# Altium project ssmaster.PrjPCB
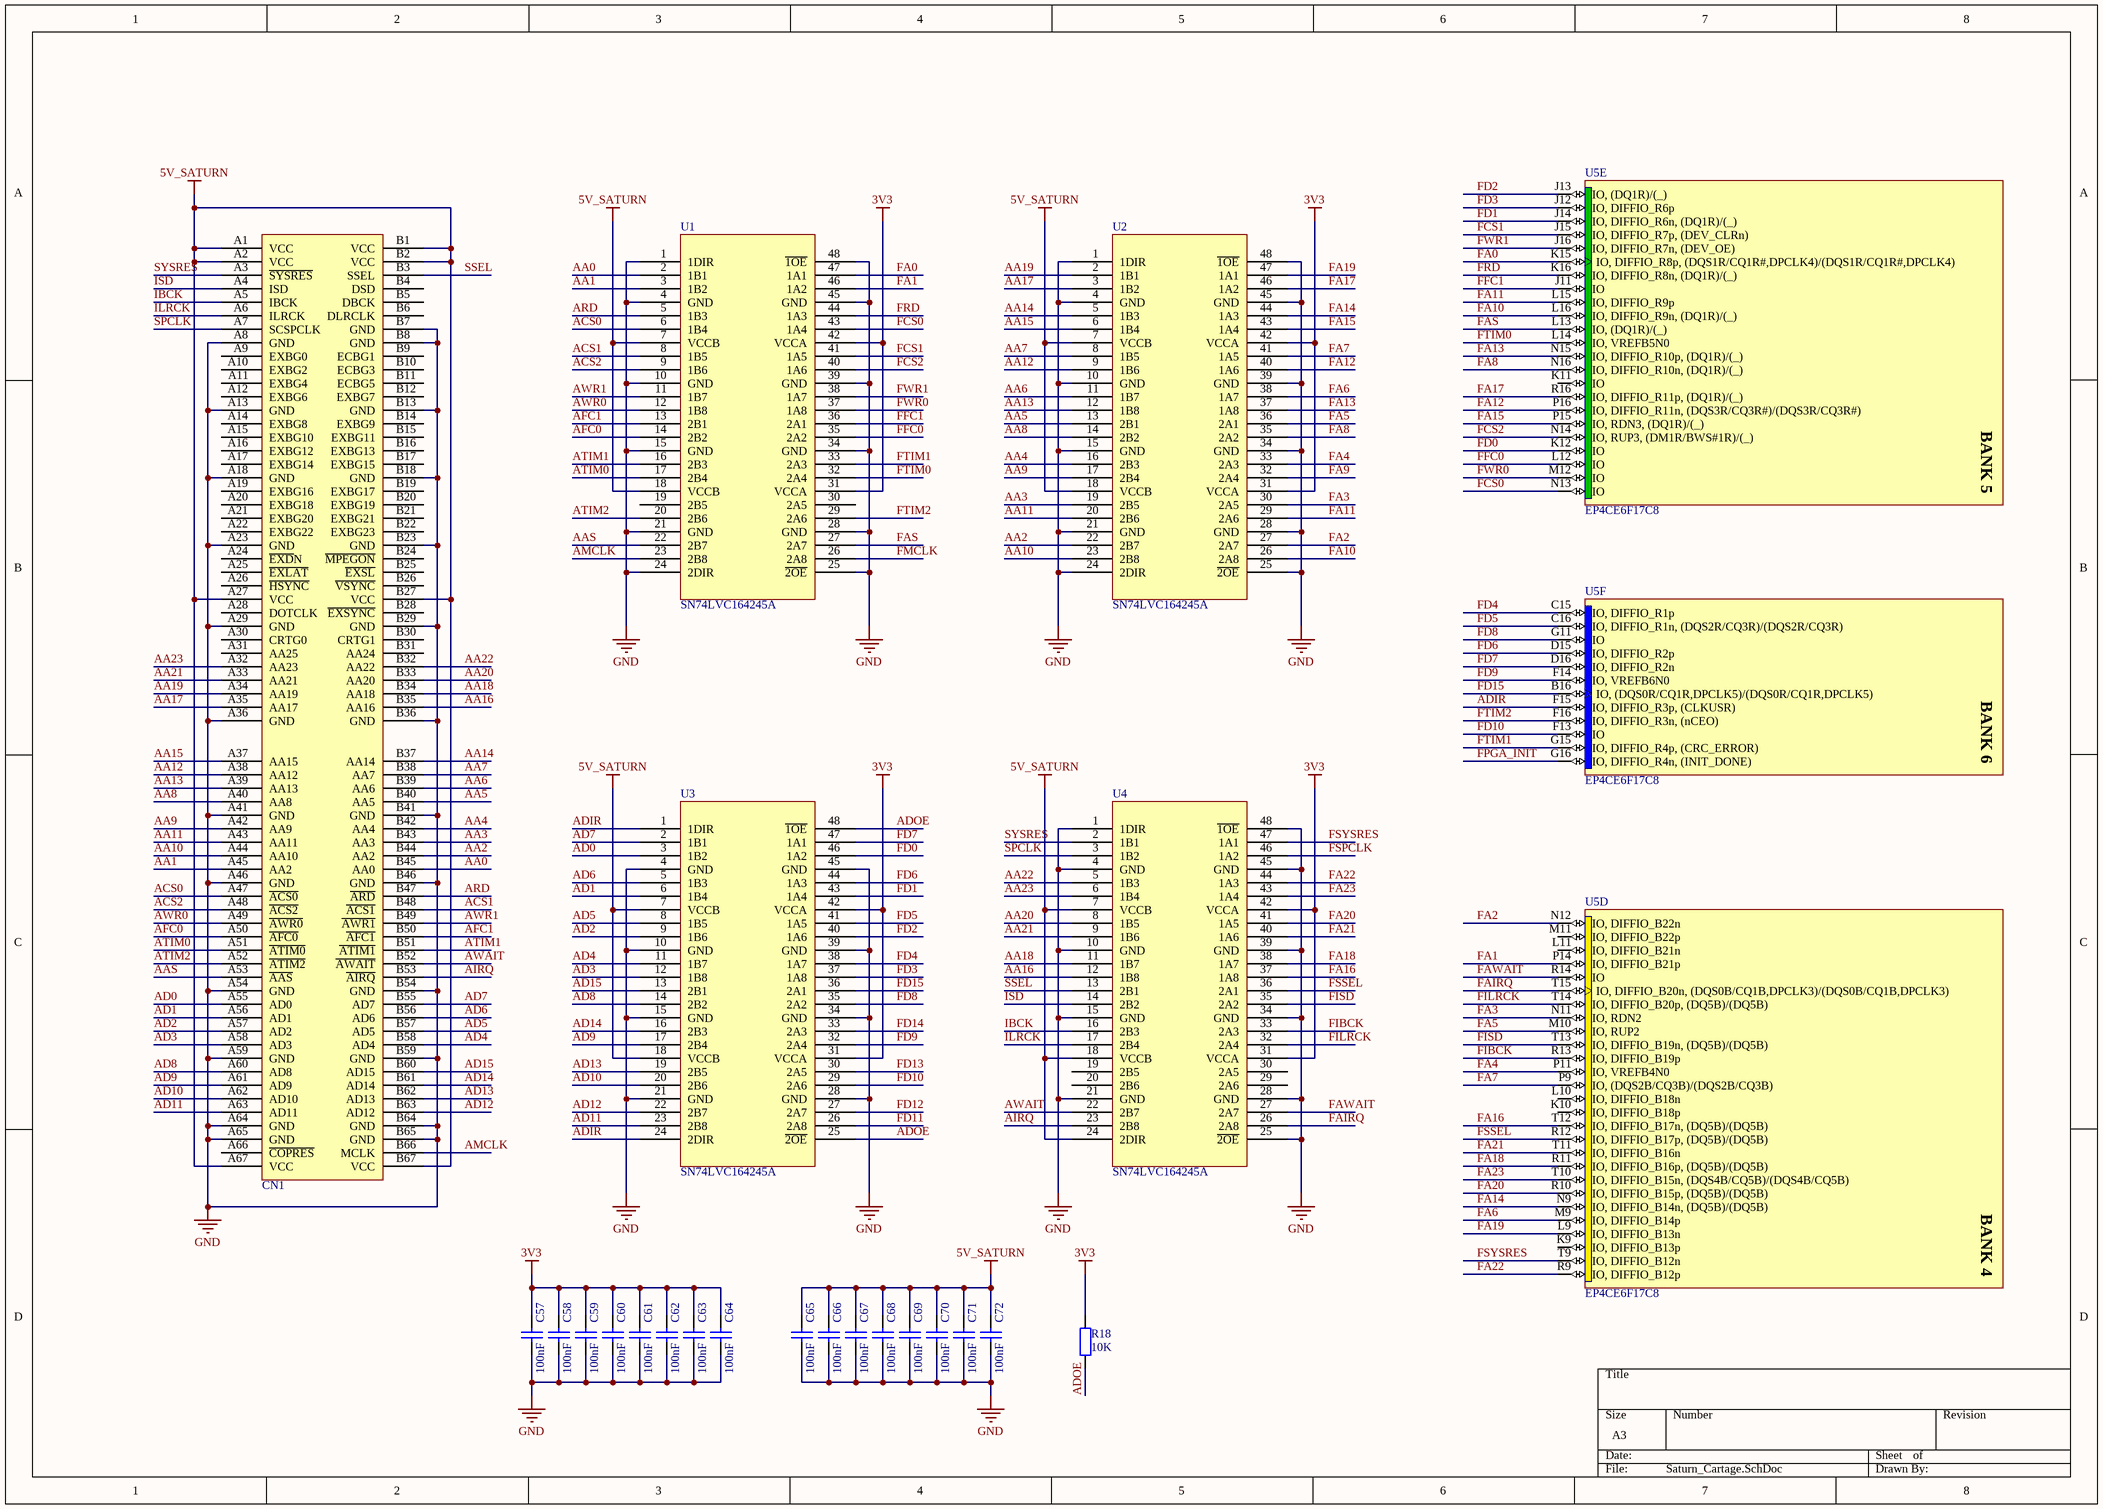
[diagram p0: Saturn_Cartage.SchDoc]
3 sheets, 87 parts. Net scope: global (net labels, ports and power ports of the same name join across sheets).
Board file: ssmaster.PcbDoc
Sheets:
  Saturn_Cartage.SchDoc
  STM32.SchDoc
  Power.SchDoc

## Sheet Saturn_Cartage.SchDoc
size A3

### Parts
C57  100nF  [C0603]
C58  100nF  [C0603]
C59  100nF  [C0603]
C60  100nF  [C0603]
C61  100nF  [C0603]
C62  100nF  [C0603]
C63  100nF  [C0603]
C64  100nF  [C0603]
C65  100nF  [C0603]
C66  100nF  [C0603]
C67  100nF  [C0603]
C68  100nF  [C0603]
C69  100nF  [C0603]
C70  100nF  [C0603]
C71  100nF  [C0603]
C72  100nF  [C0603]
CN1  SaturnCartage  [Saturn_cart]  (value not drawn)
R18  10K  [R0603]
U1  SN74LVC164245A  [DGG048]
U2  SN74LVC164245A  [DGG048]
U3  SN74LVC164245A  [DGG048]
U4  SN74LVC164245A  [DGG048]
U5  EP4CE6F17C8  [FBGA256]  (parts D,E,F of 13)

### Nets
3V3: C57.2 C58.2 C59.2 C60.2 C61.2 C62.2 C63.2 C64.2 R18.2 U1.31(VCCA) U1.42(VCCA) U2.31(VCCA) U2.42(VCCA) U3.31(VCCA) U3.42(VCCA) U4.31(VCCA) U4.42(VCCA)
5V_SATURN: C65.2 C66.2 C67.2 C68.2 C69.2 C70.2 C71.2 C72.2 CN1.A1(VCC) CN1.A2(VCC) CN1.A27(VCC) CN1.A67(VCC) CN1.B1(VCC) CN1.B2(VCC) CN1.B27(VCC) CN1.B67(VCC) U1.7(VCCB) U1.18(VCCB) U2.7(VCCB) U2.18(VCCB) U3.7(VCCB) U3.18(VCCB) U4.7(VCCB) U4.18(VCCB) U4.24(2DIR)
GND: C57.1 C58.1 C59.1 C60.1 C61.1 C62.1 C63.1 C64.1 C65.1 C66.1 C67.1 C68.1 C69.1 C70.1 C71.1 C72.1 CN1.A8(GND) CN1.A13(GND) CN1.A18(GND) CN1.A23(GND) CN1.A29(GND) CN1.A36(GND) CN1.A41(GND) CN1.A46(GND) CN1.A54(GND) CN1.A59(GND) CN1.A64(GND) CN1.A65(GND) CN1.B7(GND) CN1.B8(GND) CN1.B13(GND) CN1.B18(GND) CN1.B23(GND) CN1.B29(GND) CN1.B36(GND) CN1.B41(GND) CN1.B46(GND) CN1.B54(GND) CN1.B59(GND) CN1.B64(GND) CN1.B65(GND) U1.1(1DIR) U1.4(GND) U1.10(GND) U1.15(GND) U1.21(GND) U1.24(2DIR) U1.25(~{2OE}) U1.28(GND) U1.34(GND) U1.39(GND) U1.45(GND) U1.48(~{1OE}) U2.1(1DIR) U2.4(GND) U2.10(GND) U2.15(GND) U2.21(GND) U2.24(2DIR) U2.25(~{2OE}) U2.28(GND) U2.34(GND) U2.39(GND) U2.45(GND) U2.48(~{1OE}) U3.4(GND) U3.10(GND) U3.15(GND) U3.21(GND) U3.28(GND) U3.34(GND) U3.39(GND) U3.45(GND) U4.1(1DIR) U4.4(GND) U4.10(GND) U4.15(GND) U4.21(GND) U4.25(~{2OE}) U4.28(GND) U4.34(GND) U4.39(GND) U4.45(GND) U4.48(~{1OE})
AA0: CN1.B45(AA0) U1.2(1B1)
AA1: CN1.A45(AA2) U1.3(1B2)
AA2: CN1.B44(AA2) U2.22(2B7)
AA3: CN1.B43(AA3) U2.19(2B5)
AA4: CN1.B42(AA4) U2.16(2B3)
AA5: CN1.B40(AA5) U2.13(2B1)
AA6: CN1.B39(AA6) U2.11(1B7)
AA7: CN1.B38(AA7) U2.8(1B5)
AA8: CN1.A40(AA8) U2.14(2B2)
AA9: CN1.A42(AA9) U2.17(2B4)
AA10: CN1.A44(AA10) U2.23(2B8)
AA11: CN1.A43(AA11) U2.20(2B6)
AA12: CN1.A38(AA12) U2.9(1B6)
AA13: CN1.A39(AA13) U2.12(1B8)
AA14: CN1.B37(AA14) U2.5(1B3)
AA15: CN1.A37(AA15) U2.6(1B4)
AA16: CN1.B35(AA16) U4.12(1B8)
AA17: CN1.A35(AA17) U2.3(1B2)
AA18: CN1.B34(AA18) U4.11(1B7)
AA19: CN1.A34(AA19) U2.2(1B1)
AA20: CN1.B33(AA20) U4.8(1B5)
AA21: CN1.A33(AA21) U4.9(1B6)
AA22: CN1.B32(AA22) U4.5(1B3)
AA23: CN1.A32(AA23) U4.6(1B4)
AAS: CN1.A53(~{AAS}) U1.22(2B7)
ACS0: CN1.A47(~{ACS0}) U1.6(1B4)
ACS1: CN1.B48(~{ACS1}) U1.8(1B5)
ACS2: CN1.A48(~{ACS2}) U1.9(1B6)
AD0: CN1.A55(AD0) U3.3(1B2)
AD1: CN1.A56(AD1) U3.6(1B4)
AD2: CN1.A57(AD2) U3.9(1B6)
AD3: CN1.A58(AD3) U3.12(1B8)
AD4: CN1.B58(AD4) U3.11(1B7)
AD5: CN1.B57(AD5) U3.8(1B5)
AD6: CN1.B56(AD6) U3.5(1B3)
AD7: CN1.B55(AD7) U3.2(1B1)
AD8: CN1.A60(AD8) U3.14(2B2)
AD9: CN1.A61(AD9) U3.17(2B4)
AD10: CN1.A62(AD10) U3.20(2B6)
AD11: CN1.A63(AD11) U3.23(2B8)
AD12: CN1.B63(AD12) U3.22(2B7)
AD13: CN1.B62(AD13) U3.19(2B5)
AD14: CN1.B61(AD14) U3.16(2B3)
AD15: CN1.B60(AD15) U3.13(2B1)
ADIR: U3.1(1DIR) U3.24(2DIR) U5.F15(IO,_DIFFIO_R3p,_(CLKUSR))
ADOE: R18.1 U3.25(~{2OE}) U3.48(~{1OE})
AFC0: CN1.A50(~{AFC0}) U1.14(2B2)
AFC1: CN1.B50(~{AFC1}) U1.13(2B1)
AIRQ: CN1.B53(~{AIRQ}) U4.23(2B8)
AMCLK: CN1.B66(MCLK) U1.23(2B8)
ARD: CN1.B47(~{ARD}) U1.5(1B3)
ATIM0: CN1.A51(~{ATIM0}) U1.17(2B4)
ATIM1: CN1.B51(~{ATIM1}) U1.16(2B3)
ATIM2: CN1.A52(~{ATIM2}) U1.20(2B6)
AWAIT: CN1.B52(~{AWAIT}) U4.22(2B7)
AWR0: CN1.A49(~{AWR0}) U1.12(1B8)
AWR1: CN1.B49(~{AWR1}) U1.11(1B7)
FA0: U1.47(1A1) U5.K15(IO,_DIFFIO_R8p,_(DQS1R/CQ1R#,DPCLK4)/(DQS1R/CQ1R#,DPCLK4))
FA1: U1.46(1A2) U5.P14(IO,_DIFFIO_B21p)
FA2: U2.27(2A7) U5.N12(IO,_DIFFIO_B22n)
FA3: U2.30(2A5) U5.N11(IO,_RDN2)
FA4: U2.33(2A3) U5.P11(IO,_VREFB4N0)
FA5: U2.36(2A1) U5.M10(IO,_RUP2)
FA6: U2.38(1A7) U5.M9(IO,_DIFFIO_B14p)
FA7: U2.41(1A5) U5.P9(IO,_(DQS2B/CQ3B)/(DQS2B/CQ3B))
FA8: U2.35(2A2) U5.N16(IO,_DIFFIO_R10n,_(DQ1R)/(_))
FA9: U2.32(2A4)
FA10: U2.26(2A8) U5.L16(IO,_DIFFIO_R9n,_(DQ1R)/(_))
FA11: U2.29(2A6) U5.L15(IO,_DIFFIO_R9p)
FA12: U2.40(1A6) U5.P16(IO,_DIFFIO_R11n,_(DQS3R/CQ3R#)/(DQS3R/CQ3R#))
FA13: U2.37(1A8) U5.N15(IO,_DIFFIO_R10p,_(DQ1R)/(_))
FA14: U2.44(1A3) U5.N9(IO,_DIFFIO_B14n,_(DQ5B)/(DQ5B))
FA15: U2.43(1A4) U5.P15(IO,_RDN3,_(DQ1R)/(_))
FA16: U4.37(1A8) U5.T12(IO,_DIFFIO_B17n,_(DQ5B)/(DQ5B))
FA17: U2.46(1A2) U5.R16(IO,_DIFFIO_R11p,_(DQ1R)/(_))
FA18: U4.38(1A7) U5.R11(IO,_DIFFIO_B16p,_(DQ5B)/(DQ5B))
FA19: U2.47(1A1) U5.L9(IO,_DIFFIO_B13n)
FA20: U4.41(1A5) U5.R10(IO,_DIFFIO_B15p,_(DQ5B)/(DQ5B))
FA21: U4.40(1A6) U5.T11(IO,_DIFFIO_B16n)
FA22: U4.44(1A3) U5.R9(IO,_DIFFIO_B12p)
FA23: U4.43(1A4) U5.T10(IO,_DIFFIO_B15n,_(DQS4B/CQ5B)/(DQS4B/CQ5B))
FAIRQ: U4.26(2A8) U5.T15(IO,_DIFFIO_B20n,_(DQS0B/CQ1B,DPCLK3)/(DQS0B/CQ1B,DPCLK3))
FAS: U1.27(2A7) U5.L13(IO,_(DQ1R)/(_))
FAWAIT: U4.27(2A7) U5.R14(IO)
FCS0: U1.43(1A4) U5.N13(IO)
FCS1: U1.41(1A5) U5.J15(IO,_DIFFIO_R7p,_(DEV_CLRn))
FCS2: U1.40(1A6) U5.N14(IO,_RUP3,_(DM1R/BWS#1R)/(_))
FD0: U3.46(1A2) U5.K12(IO)
FD1: U3.43(1A4) U5.J14(IO,_DIFFIO_R6n,_(DQ1R)/(_))
FD2: U3.40(1A6) U5.J13(IO,_(DQ1R)/(_))
FD3: U3.37(1A8) U5.J12(IO,_DIFFIO_R6p)
FD4: U3.38(1A7) U5.C15(IO,_DIFFIO_R1p)
FD5: U3.41(1A5) U5.C16(IO,_DIFFIO_R1n,_(DQS2R/CQ3R)/(DQS2R/CQ3R))
FD6: U3.44(1A3) U5.D15(IO,_DIFFIO_R2p)
FD7: U3.47(1A1) U5.D16(IO,_DIFFIO_R2n)
FD8: U3.35(2A2) U5.G11(IO)
FD9: U3.32(2A4) U5.F14(IO,_VREFB6N0)
FD10: U3.29(2A6) U5.F13(IO)
FD11: U3.26(2A8)
FD12: U3.27(2A7)
FD13: U3.30(2A5)
FD14: U3.33(2A3)
FD15: U3.36(2A1) U5.B16(IO,_(DQS0R/CQ1R,DPCLK5)/(DQS0R/CQ1R,DPCLK5))
FFC0: U1.35(2A2) U5.L12(IO)
FFC1: U1.36(2A1) U5.J11(IO)
FIBCK: U4.33(2A3) U5.R13(IO,_DIFFIO_B19p)
FILRCK: U4.32(2A4) U5.T14(IO,_DIFFIO_B20p,_(DQ5B)/(DQ5B))
FISD: U4.35(2A2) U5.T13(IO,_DIFFIO_B19n,_(DQ5B)/(DQ5B))
FMCLK: U1.26(2A8)
FPGA_INIT: U5.G16(IO,_DIFFIO_R4n,_(INIT_DONE))
FRD: U1.44(1A3) U5.K16(IO,_DIFFIO_R8n,_(DQ1R)/(_))
FSPCLK: U4.46(1A2)
FSSEL: U4.36(2A1) U5.R12(IO,_DIFFIO_B17p,_(DQ5B)/(DQ5B))
FSYSRES: U4.47(1A1) U5.T9(IO,_DIFFIO_B12n)
FTIM0: U1.32(2A4) U5.L14(IO,_VREFB5N0)
FTIM1: U1.33(2A3) U5.G15(IO,_DIFFIO_R4p,_(CRC_ERROR))
FTIM2: U1.29(2A6) U5.F16(IO,_DIFFIO_R3n,_(nCEO))
FWR0: U1.37(1A8) U5.M12(IO)
FWR1: U1.38(1A7) U5.J16(IO,_DIFFIO_R7n,_(DEV_OE))
IBCK: CN1.A5(IBCK) U4.16(2B3)
ILRCK: CN1.A6(ILRCK) U4.17(2B4)
ISD: CN1.A4(ISD) U4.14(2B2)
SPCLK: CN1.A7(SCSPCLK) U4.3(1B2)
SSEL: CN1.B3(SSEL) U4.13(2B1)
SYSRES: CN1.A3(~{SYSRES}) U4.2(1B1)

Not connected (* = marked no-connect by the designer): CN1 A9(EXBG0) A10(EXBG2) A11(EXBG4) A12(EXBG6) A14(EXBG8) A15(EXBG10) A16(EXBG12) A17(EXBG14) A19(EXBG16) A20(EXBG18) A21(EXBG20) A22(EXBG22) A24(~{EXD}N) A25(~{EXLAT}) A26(~{HSYNC}) A28(DOTCLK) A30(CRTG0) A31(AA25) A66(~{COPRES}) B4(DSD) B5(DBCK) B6(DLRCLK) B9(ECBG1) B10(ECBG3) B11(ECBG5) B12(EXBG7) B14(EXBG9) B15(EXBG11) B16(EXBG13) B17(EXBG15) B19(EXBG17) B20(EXBG19) B21(EXBG21) B22(EXBG23) B24(~{MPEGON}) B25(~{EXSL}) B26(~{VSYNC}) B28(~{EXSYNC}) B30(CRTG1) B31(AA24); U1 19(2B5) 30(2A5); U4 19(2B5) 20(2B6) 29(2A6) 30(2A5); U5 K9(IO,_DIFFIO_B13p) K10(IO,_DIFFIO_B18p) K11(IO) L10(IO,_DIFFIO_B18n) L11(IO,_DIFFIO_B21n) M11(IO,_DIFFIO_B22p)

### Notes on the sheet
- (in symbol EP4CE6F17C8, part D) BANK 4
- (in symbol EP4CE6F17C8, part E) BANK 5
- (in symbol EP4CE6F17C8, part F) BANK 6

### Library data of the parts
C57-C72 = Cap: Capacitor; Published: 8-Jun-2000; LatestRevisionDate: 17-Jul-2002; LatestRevisionNote: Re-released for DXP Platform.; PackageReference: RAD-0.3; Publisher: Altium Limited
R18 = Res2: Resistor; Published: 8-Jun-2000; LatestRevisionDate: 17-Jul-2002; LatestRevisionNote: Re-released for DXP Platform.; PackageReference: AXIAL-0.4; Publisher: Altium Limited
U5 = EP4CE6F17C8: Cyclone IV Family FPGA, 2V Core, 179 I/O Pins, 2 PLLs, 256-Pin FBGA, Speed Grade 8, Commercial Grade; Published: 3-May-2010; DatasheetVersion: ver1.2, Mar-2010; PackageVersion: ver16.0, Dec-2009; PackageReference: FBGA256; Publisher: Altium Limited; PackageDescription: 256-Ball FineLine Ball Grid Array (FBGA256) - Option 1 - Wire Bond; Code_JEDEC: MS-034-AAF-1; Code_IPC: BGA100P16X16-256; ComponentLink1Description: Manufacturer Link; ComponentLink1URL: http://www.altera.com/; ComponentLink2Description: Handbook; ComponentLink2URL: http://www.altera.com/literature/hb/cyclone-iv/cyclone4-handbook.pdf; ComponentLink3Description: Pinout Specification; ComponentLink3URL: http://www.altera.com/literature/lit-dp.jsp?category=cyc%204&showspreadsheet=y; ComponentLink4Description: Packaging Specification; ComponentLink4URL: http://www.altera.com/literature/ds/dspkg.pdf

## Sheet STM32.SchDoc
size A3
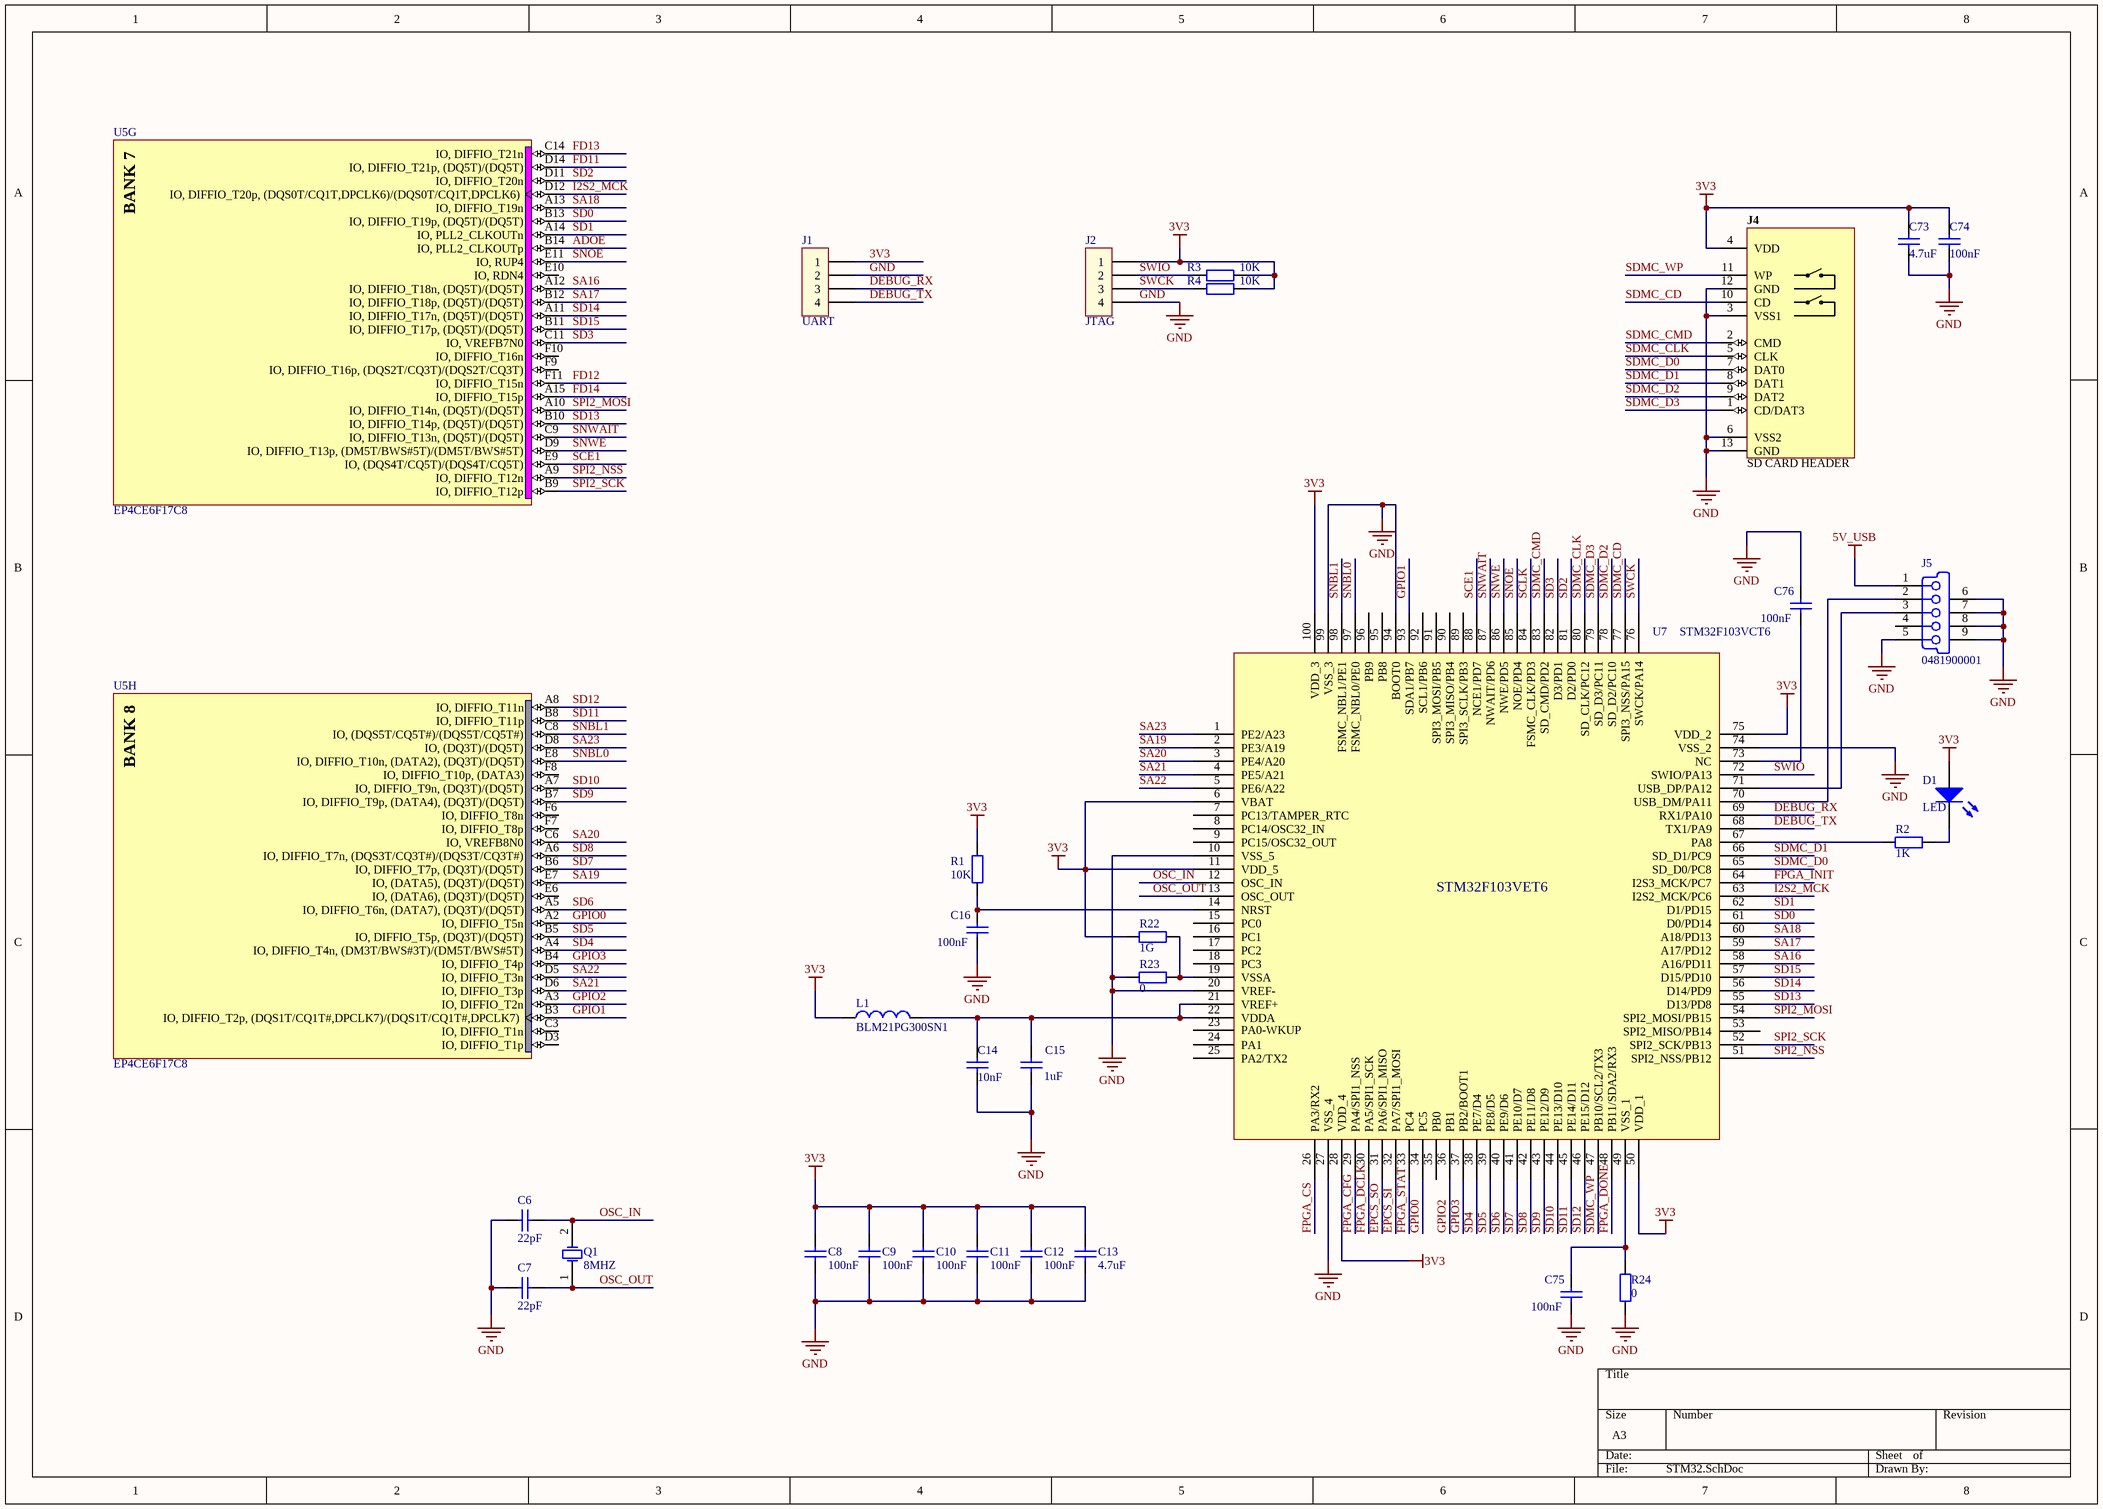
[diagram p1: STM32.SchDoc]

### Parts
C6  22pF  [C0603]
C7  22pF  [C0603]
C8  100nF  [C0603]
C9  100nF  [C0603]
C10  100nF  [C0603]
C11  100nF  [C0603]
C12  100nF  [C0603]
C13  4.7uF  [C0603]
C14  10nF  [C0603]
C15  1uF  [C0603]
C16  100nF  [C0603]
C73  4.7uF  [C0603]
C74  100nF  [C0603]
C75  100nF  [C0603]
C76  100nF  [C0603]
D1  LED  [D0603]
J1  UART  [SIP4]
J2  JTAG  [SIP4]
J4  SD CARD HEADER  [KSDC012551]
J5  0481900001  [Micro USB]
L1  BLM21PG300SN1  [R0805]
Q1  8MHZ  [SMD_CRYSTAL]
R1  10K  [R0603]
R2  1K  [R0603]
R3  10K  [R0603]
R4  10K  [R0603]
R22  1G  [R0603]
R23  0  [R0603]
R24  0  [R0603]
U5  EP4CE6F17C8  [FBGA256]  (parts G,H of 13)
U7  STM32F103VCT6  [TQFP-100]

### Nets
3V3: C8.2 C9.2 C10.2 C11.2 C12.2 C13.2 C73.2 C74.2 D1.1 J1.1 J2.1 J4.4(VDD) L1.1 R1.2 R3.2 R4.2 R22.2 U7.6(VBAT) U7.11(VDD_5) U7.28(VDD_4) U7.50(VDD_1) U7.75(VDD_2) U7.100(VDD_3)
5V_USB: J5.1(V_BUS_(5V))
GND: C6.2 C7.2 C8.1 C9.1 C10.1 C11.1 C12.1 C13.1 C14.1 C15.1 C16.2 C73.1 C74.1 C75.2 C76.1 J1.2 J2.4 J4.3(VSS1) J4.6(VSS2) J4.12(GND) J4.13(GND) J5.5(GND) J5.6(Tab) J5.7(Tab) J5.8(Tab) J5.9(Tab) R23.2 R24.2 U7.10(VSS_5) U7.20(VREF-) U7.27(VSS_4) U7.74(VSS_2) U7.94(BOOT0) U7.99(VSS_3)
ADOE: U5.B14(IO,_PLL2_CLKOUTp)
DEBUG_RX: J1.3 U7.69(RX1/PA10)
DEBUG_TX: J1.4 U7.68(TX1/PA9)
EPCS_SI: U7.32(PA7/SPI1_MOSI)
EPCS_SO: U7.31(PA6/SPI1_MISO)
FD11: U5.D14(IO,_DIFFIO_T21p,_(DQ5T)/(DQ5T))
FD12: U5.F11(IO,_DIFFIO_T15n)
FD13: U5.C14(IO,_DIFFIO_T21n)
FD14: U5.A15(IO,_DIFFIO_T15p)
FPGA_CFG: U7.29(PA4/SPI1_NSS)
FPGA_CS: U7.26(PA3/RX2)
FPGA_DCLK: U7.30(PA5/SPI1_SCK)
FPGA_DONE: U7.48(PB11/SDA2/RX3)
FPGA_INIT: U7.64(I2S3_MCK/PC7)
FPGA_STAT: U7.33(PC4)
GPIO0: U5.A2(IO,_DIFFIO_T5n) U7.34(PC5)
GPIO1: U5.B3(IO,_DIFFIO_T2p,_(DQS1T/CQ1T#,DPCLK7)/(DQS1T/CQ1T#,DPCLK7)) U7.93(SDA1/PB7)
GPIO2: U5.A3(IO,_DIFFIO_T2n) U7.36(PB1)
GPIO3: U5.B4(IO,_DIFFIO_T4p) U7.37(PB2/BOOT1)
I2S2_MCK: U5.D12(IO,_DIFFIO_T20p,_(DQS0T/CQ1T,DPCLK6)/(DQS0T/CQ1T,DPCLK6)) U7.63(I2S2_MCK/PC6)
OSC_IN: C6.1 Q1.2(OSC2) U7.12(OSC_IN)
OSC_OUT: C7.1 Q1.1(OSC1) U7.13(OSC_OUT)
SA16: U5.A12(IO,_DIFFIO_T18n,_(DQ5T)/(DQ5T)) U7.58(A16/PD11)
SA17: U5.B12(IO,_DIFFIO_T18p,_(DQ5T)/(DQ5T)) U7.59(A17/PD12)
SA18: U5.A13(IO,_DIFFIO_T19n) U7.60(A18/PD13)
SA19: U5.E7(IO,_(DATA5),_(DQ3T)/(DQ5T)) U7.2(PE3/A19)
SA20: U5.C6(IO,_VREFB8N0) U7.3(PE4/A20)
SA21: U5.D6(IO,_DIFFIO_T3p) U7.4(PE5/A21)
SA22: U5.D5(IO,_DIFFIO_T3n) U7.5(PE6/A22)
SA23: U5.D8(IO,_(DQ3T)/(DQ5T)) U7.1(PE2/A23)
SCE1: U5.E9(IO,_(DQS4T/CQ5T)/(DQS4T/CQ5T)) U7.88(NCE1/PD7)
SCLK: U7.84(FSMC_CLK/PD3)
SD0: U5.B13(IO,_DIFFIO_T19p,_(DQ5T)/(DQ5T)) U7.61(D0/PD14)
SD1: U5.A14(IO,_PLL2_CLKOUTn) U7.62(D1/PD15)
SD2: U5.D11(IO,_DIFFIO_T20n) U7.81(D2/PD0)
SD3: U5.C11(IO,_VREFB7N0) U7.82(D3/PD1)
SD4: U5.A4(IO,_DIFFIO_T4n,_(DM3T/BWS#3T)/(DM5T/BWS#5T)) U7.38(PE7/D4)
SD5: U5.B5(IO,_DIFFIO_T5p,_(DQ3T)/(DQ5T)) U7.39(PE8/D5)
SD6: U5.A5(IO,_DIFFIO_T6n,_(DATA7),_(DQ3T)/(DQ5T)) U7.40(PE9/D6)
SD7: U5.B6(IO,_DIFFIO_T7p,_(DQ3T)/(DQ5T)) U7.41(PE10/D7)
SD8: U5.A6(IO,_DIFFIO_T7n,_(DQS3T/CQ3T#)/(DQS3T/CQ3T#)) U7.42(PE11/D8)
SD9: U5.B7(IO,_DIFFIO_T9p,_(DATA4),_(DQ3T)/(DQ5T)) U7.43(PE12/D9)
SD10: U5.A7(IO,_DIFFIO_T9n,_(DQ3T)/(DQ5T)) U7.44(PE13/D10)
SD11: U5.B8(IO,_DIFFIO_T11p) U7.45(PE14/D11)
SD12: U5.A8(IO,_DIFFIO_T11n) U7.46(PE15/D12)
SD13: U5.B10(IO,_DIFFIO_T14p,_(DQ5T)/(DQ5T)) U7.55(D13/PD8)
SD14: U5.A11(IO,_DIFFIO_T17n,_(DQ5T)/(DQ5T)) U7.56(D14/PD9)
SD15: U5.B11(IO,_DIFFIO_T17p,_(DQ5T)/(DQ5T)) U7.57(D15/PD10)
SDMC_CD: J4.10(CD) U7.77(SPI3_NSS/PA15)
SDMC_CLK: J4.5(CLK) U7.80(SD_CLK/PC12)
SDMC_CMD: J4.2(CMD) U7.83(SD_CMD/PD2)
SDMC_D0: J4.7(DAT0) U7.65(SD_D0/PC8)
SDMC_D1: J4.8(DAT1) U7.66(SD_D1/PC9)
SDMC_D2: J4.9(DAT2) U7.78(SD_D2/PC10)
SDMC_D3: J4.1(CD/DAT3) U7.79(SD_D3/PC11)
SDMC_WP: J4.11(WP) U7.47(PB10/SCL2/TX3)
SNBL0: U5.E8(IO,_DIFFIO_T10n,_(DATA2),_(DQ3T)/(DQ5T)) U7.97(FSMC_NBL0/PE0)
SNBL1: U5.C8(IO,_(DQS5T/CQ5T#)/(DQS5T/CQ5T#)) U7.98(FSMC_NBL1/PE1)
SNOE: U5.E11(IO,_RUP4) U7.85(NOE/PD4)
SNWAIT: U5.C9(IO,_DIFFIO_T13n,_(DQ5T)/(DQ5T)) U7.87(NWAIT/PD6)
SNWE: U5.D9(IO,_DIFFIO_T13p,_(DM5T/BWS#5T)/(DM5T/BWS#5T)) U7.86(NWE/PD5)
SPI2_MOSI: U5.A10(IO,_DIFFIO_T14n,_(DQ5T)/(DQ5T)) U7.54(SPI2_MOSI/PB15)
SPI2_NSS: U5.A9(IO,_DIFFIO_T12n) U7.51(SPI2_NSS/PB12)
SPI2_SCK: U5.B9(IO,_DIFFIO_T12p) U7.52(SPI2_SCK/PB13)
SWCK: J2.3 R4.1 U7.76(SWCK/PA14)
SWIO: J2.2 R3.1 U7.72(SWIO/PA13)
NetC14_2: C14.2 C15.2 L1.2 U7.21(VREF+) U7.22(VDDA)
NetC16_1: C16.1 R1.1 U7.14(NRST)
NetC75_1: C75.1 R24.1 U7.49(VSS_1)
NetC76_2: C76.2 U7.73(NC)
NetD1_2: D1.2 R2.1
NetJ5_2: J5.2(D-) U7.70(USB_DM/PA11)
NetJ5_3: J5.3(D+) U7.71(USB_DP/PA12)
NetR2_2: R2.2 U7.67(PA8)
NetR22_1: R22.1 R23.1 U7.19(VSSA)

Not connected (* = marked no-connect by the designer): J5 4(NC); U5 C3(IO,_DIFFIO_T1n) D3(IO,_DIFFIO_T1p) E6(IO,_(DATA6),_(DQ3T)/(DQ5T)) E10(IO,_RDN4) F6(IO,_DIFFIO_T8n) F7(IO,_DIFFIO_T8p) F8(IO,_DIFFIO_T10p,_(DATA3)) F9(IO,_DIFFIO_T16p,_(DQS2T/CQ3T)/(DQS2T/CQ3T)) F10(IO,_DIFFIO_T16n); U7 7(PC13/TAMPER_RTC) 8(PC14/OSC32_IN) 9(PC15/OSC32_OUT) 15(PC0) 16(PC1) 17(PC2) 18(PC3) 23(PA0-WKUP) 24(PA1) 25(PA2/TX2) 35(PB0) 53(SPI2_MISO/PB14) 89(SPI3_SCLK/PB3) 90(SPI3_MISO/PB4) 91(SPI3_MOSI/PB5) 92(SCL1/PB6) 95(PB8) 96(PB9)

### Notes on the sheet
- (in symbol EP4CE6F17C8, part G) BANK 7
- (in symbol EP4CE6F17C8, part H) BANK 8
- (in symbol STM32F103VCT6) STM32F103VET6

### Library data of the parts
C6-C16 C73-C76 = Cap: Capacitor; Published: 8-Jun-2000; LatestRevisionDate: 17-Jul-2002; LatestRevisionNote: Re-released for DXP Platform.; PackageReference: RAD-0.3; Publisher: Altium Limited
D1 = LED1: Typical RED GaAs LED; Published: 8-Jun-2000; LatestRevisionDate: 08-Jul-2005; LatestRevisionNote: Mech Layer 1 removed.; PackageReference: LED-1; Publisher: Altium Limited
J1 J2 = SIP4
J4 = KSDC012551-9: Secure Digital Card Socket; Max Current: mA; Connector type: Header; Mounting Technology: Surface Mount; Status: Production; Category: Connector
J5 = 0481900001: USB On-The-Go (OTG) Mini-B Receptacle, Right Angle, SMT, 0.80mm (.031") Pitch, Solder Tabs with Back Cover, Recessed Type; PCB_Layout: Complies with Manufacturer's Recommendation.; Published: 21-Sep-2007; DatasheetVersion: revA, May-2004; PackageVersion: May-2004; PackageReference: 481900001; Publisher: Altium Limited; PackageDescription: USB Mini-B, Sinking Type, SM; 5 Position; Right Angle, Body 11.45 x 11.8 x 3.9 mm (LxWxH); ComponentLink1Description: Manufacturer Link; ComponentLink1URL: http://www.molex.com/; ComponentLink2Description: Datasheet; ComponentLink2URL: http://www.molex.com/cmc_upload/0/000/895/958/SD-48190-001RevA.pdf
L1 = Inductor: Code_IEC: 1005; Published: 8-Jun-2000; LatestRevisionDate: 17-Jul-2002; LatestRevisionNote: Re-released for DXP Platform.; PackageReference: 0402-A; Publisher: Altium Limited; Code_JEITA: 0402
Q1 = XTAL: Crystal Oscillator; Published: 8-Jun-2000; LatestRevisionDate: 17-Jul-2002; LatestRevisionNote: Re-released for DXP Platform.; PackageReference: R38; Publisher: Altium Limited
R1-R4 R22-R24 = Res2: Resistor; Published: 8-Jun-2000; LatestRevisionDate: 17-Jul-2002; LatestRevisionNote: Re-released for DXP Platform.; PackageReference: AXIAL-0.4; Publisher: Altium Limited
U5 = EP4CE6F17C8: as U5 on sheet Saturn_Cartage; Published: 3-May-2010; DatasheetVersion: ver1.2, Mar-2010; PackageVersion: ver16.0, Dec-2009; PackageReference: FBGA256; Publisher: Altium Limited; PackageDescription: 256-Ball FineLine Ball Grid Array (FBGA256) - Option 1 - Wire Bond; Code_JEDEC: MS-034-AAF-1; Code_IPC: BGA100P16X16-256; ComponentLink1Description: Manufacturer Link; ComponentLink1URL: http://www.altera.com/; ComponentLink2Description: Handbook; ComponentLink2URL: http://www.altera.com/literature/hb/cyclone-iv/cyclone4-handbook.pdf; ComponentLink3Description: Pinout Specification; ComponentLink3URL: http://www.altera.com/literature/lit-dp.jsp?category=cyc%204&showspreadsheet=y; ComponentLink4Description: Packaging Specification; ComponentLink4URL: http://www.altera.com/literature/ds/dspkg.pdf

## Sheet Power.SchDoc
size A4
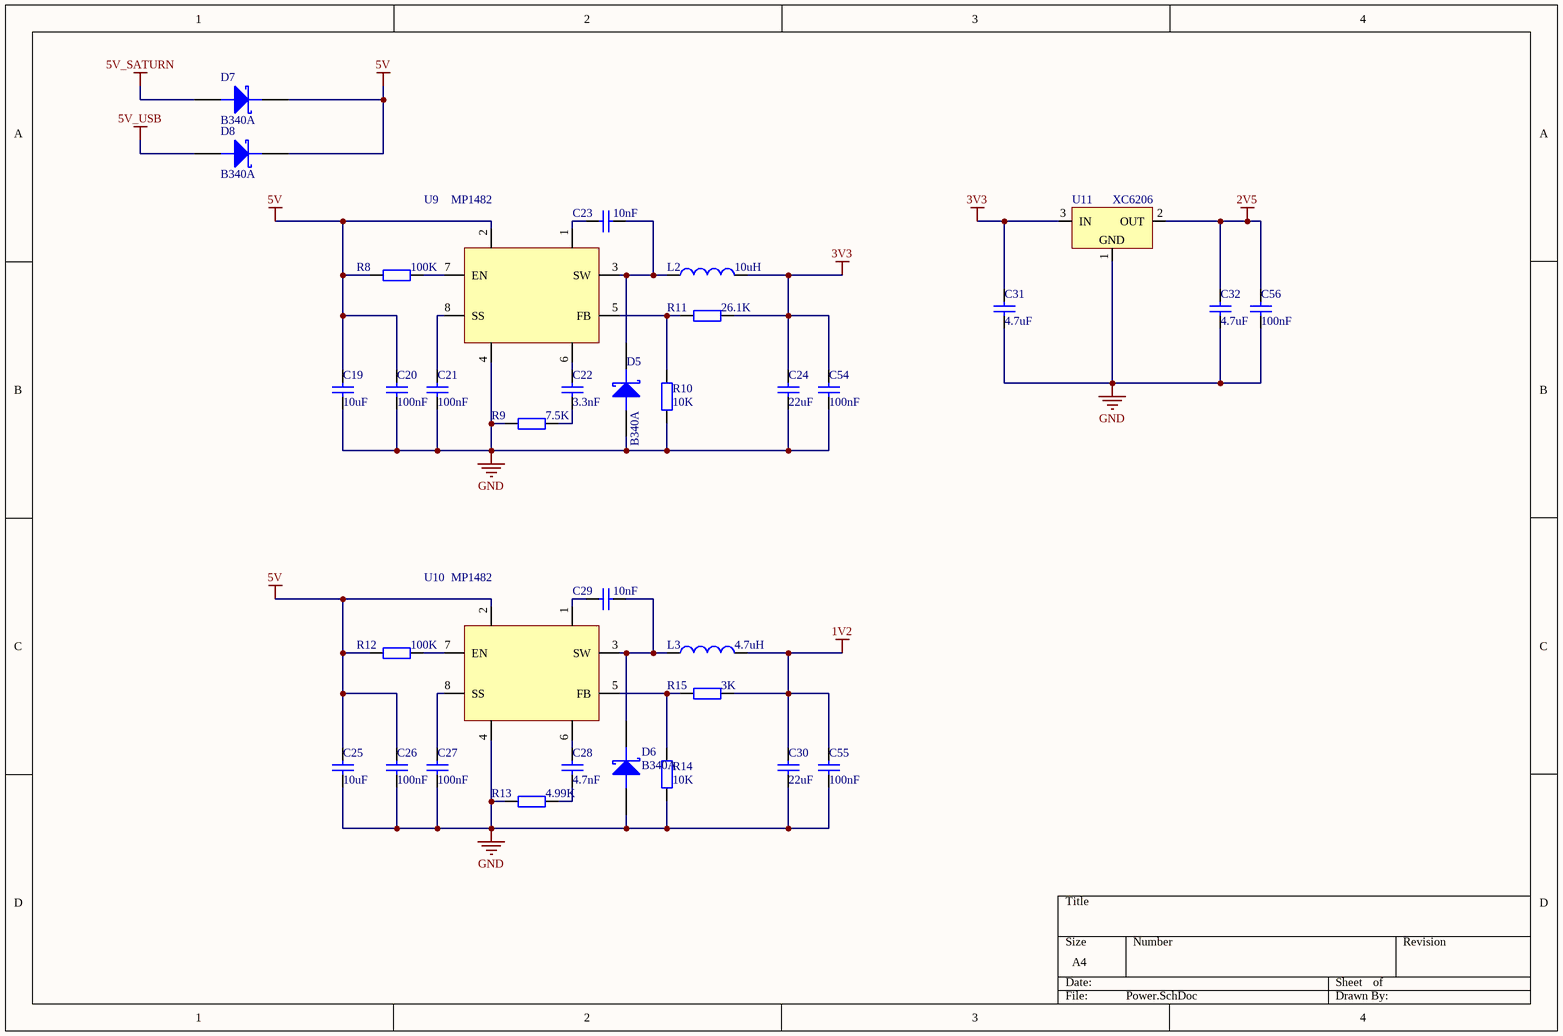
[diagram p2: Power.SchDoc]

### Parts
C19  10uF  [C1206]
C20  100nF  [C0603]
C21  100nF  [C0603]
C22  3.3nF  [C0603]
C23  10nF  [C0603]
C24  22uF  [C1206]
C25  10uF  [C1206]
C26  100nF  [C0603]
C27  100nF  [C0603]
C28  4.7nF  [C0603]
C29  10nF  [C0603]
C30  22uF  [C1206]
C31  4.7uF  [C0603]
C32  4.7uF  [C0603]
C54  100nF  [C0603]
C55  100nF  [C0603]
C56  100nF  [C0603]
D5  B340A  [SMA]
D6  B340A  [SMA]
D7  B340A  [SMA]
D8  B340A  [SMA]
L2  10uH  [CDRH5D28]
L3  4.7uH  [CDRH5D28]
R8  100K  [R0603]
R9  7.5K  [R0603]
R10  10K  [R0603]
R11  26.1K  [R0603]
R12  100K  [R0603]
R13  4.99K  [R0603]
R14  10K  [R0603]
R15  3K  [R0603]
U9  MP1482  [SOIC-8]
U10  MP1482  [SOIC-8]
U11  XC6206  [SOT-23]

### Nets
1V2: C30.1 C55.2 L3.2 R15.1
2V5: C32.2 C56.2 U11.2(OUT)
3V3: C24.1 C31.2 C54.2 L2.2 R11.1 U11.3(IN)
5V: C19.2 C20.2 C25.2 C26.2 D7.2(K) D8.2(K) R8.2 R12.2 U9.2(IN) U10.2(IN)
5V_SATURN: D7.1(A)
5V_USB: D8.1(A)
GND: C19.1 C20.1 C21.1 C24.2 C25.1 C26.1 C27.1 C30.2 C31.1 C32.1 C54.1 C55.1 C56.1 D5.1(A) D6.1(A) R9.2 R10.1 R13.2 R14.1 U9.4(GND) U10.4(GND) U11.1(GND)
NetC21_2: C21.2 U9.8(SS)
NetC22_1: C22.1 R9.1
NetC22_2: C22.2 U9.6(COMP)
NetC23_1: C23.1 D5.2(K) L2.1 U9.3(SW)
NetC23_2: C23.2 U9.1(BS)
NetC27_2: C27.2 U10.8(SS)
NetC28_1: C28.1 R13.1
NetC28_2: C28.2 U10.6(COMP)
NetC29_1: C29.1 D6.2(K) L3.1 U10.3(SW)
NetC29_2: C29.2 U10.1(BS)
NetR8_1: R8.1 U9.7(EN)
NetR10_2: R10.2 R11.2 U9.5(FB)
NetR12_1: R12.1 U10.7(EN)
NetR14_2: R14.2 R15.2 U10.5(FB)

### Library data of the parts
C19-C32 C54-C56 = Cap: Capacitor; Published: 8-Jun-2000; LatestRevisionDate: 17-Jul-2002; LatestRevisionNote: Re-released for DXP Platform.; PackageReference: RAD-0.3; Publisher: Altium Limited
D5-D8 = DIODE SCHOTTKY: Schottky Diode
L2 L3 = Inductor: Code_IEC: 1005; Published: 8-Jun-2000; LatestRevisionDate: 17-Jul-2002; LatestRevisionNote: Re-released for DXP Platform.; PackageReference: 0402-A; Publisher: Altium Limited; Code_JEITA: 0402
R8-R15 = Res2: Resistor; Published: 8-Jun-2000; LatestRevisionDate: 17-Jul-2002; LatestRevisionNote: Re-released for DXP Platform.; PackageReference: AXIAL-0.4; Publisher: Altium Limited
U11 = XC6206: LDO

## Nets that join several sheets
3V3: Saturn_Cartage (17 pins), STM32 (23 pins), Power (6 pins)
5V_SATURN: Saturn_Cartage (25 pins), Power (D7.1)
5V_USB: STM32 (J5.1), Power (D8.1)
GND: Saturn_Cartage (84 pins), STM32 (34 pins), Power (22 pins)
ADOE: Saturn_Cartage (R18.1 U3.25 U3.48), STM32 (U5.B14)
FD11: Saturn_Cartage (U3.26), STM32 (U5.D14)
FD12: Saturn_Cartage (U3.27), STM32 (U5.F11)
FD13: Saturn_Cartage (U3.30), STM32 (U5.C14)
FD14: Saturn_Cartage (U3.33), STM32 (U5.A15)
FPGA_INIT: Saturn_Cartage (U5.G16), STM32 (U7.64)